# Altium schematic sheet BMS.SchDoc
size A
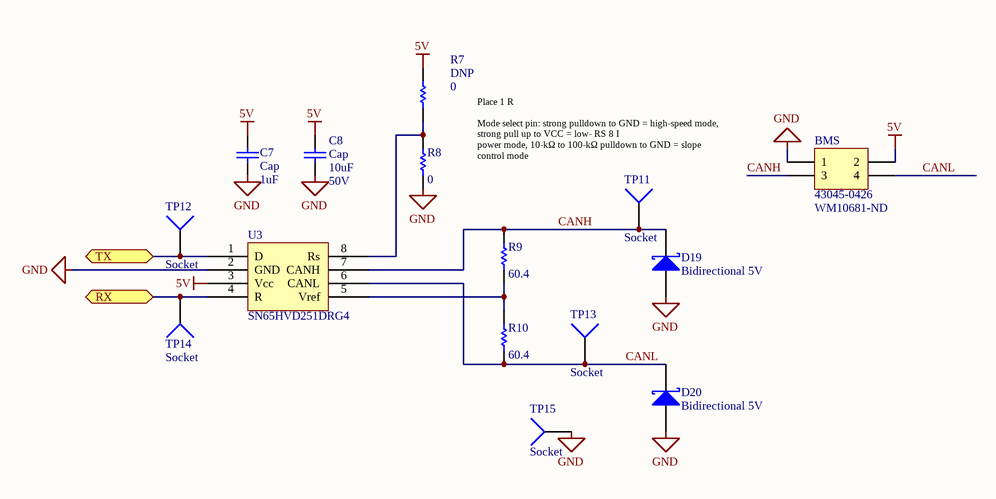
[diagram p0: BMS.SchDoc]

## Parts
BMS  43045-0426  Vendor Part Number: WM10681-ND  [43045-0426]
C7  Cap  value 1uF  [RESC3116X65N]
C8  Cap  value 10uF  Voltage Rating: 50V  [CAPC3216X180N]
D19  Bidirectional 5V  [THRMC0603X33N]
D20  Bidirectional 5V  [THRMC0603X33N]
R7  value 0  [0402]  (hidden comment: Res1)
R8  value 0  [0402]  (hidden comment: Res1)
R9  value 60.4  [0402]  (hidden comment: Res1)
R10  value 60.4  [0402]  (hidden comment: Res1)
TP11  Socket  [5006]
TP12  Socket  [5006]
TP13  Socket  [5006]
TP14  Socket  [5006]
TP15  Socket  [5006]
U3  SN65HVD251DRG4  [SOIC127P599X175-8N]

## Ports
RX, TX

## Nets
5V: BMS.2 C7.2 C8.2 R7.1 U3.3(Vcc)
GND: BMS.1 C7.1 C8.1 D19.3(A) D20.3(A) R8.2 TP15.1 U3.2(GND)
CANH: BMS.3 D19.1(K) R9.1 TP11.1 U3.7(CANH)
CANL: BMS.4 D20.1(K) R10.2 TP13.1 U3.6(CANL)
RX: TP14.1 U3.4(R) ; port RX
TX: TP12.1 U3.1(D) ; port TX
NetR7_2: R7.2 R8.1 U3.8(Rs)
NetR9_2: R9.2 R10.1 U3.5(Vref)

## Notes on the sheet
- Place 1 R
  Mode select pin: strong pulldown to GND = high-speed mode, strong pull up to VCC = low- RS 8 I
  power mode, 10-kΩ to 100-kΩ pulldown to GND = slope control mode

## Library data of the parts
BMS = Header 2X2: Header, 2-Pin, Dual row; LatestRevisionDate: 17-Jul-2002; LatestRevisionNote: Re-released for DXP Platform.; Publisher: Altium Limited
C7 = Cap: Capacitor; Manufacturer Part Number: CL31B105KCHNNNE; Vendor Part Number: 1276-1838-1-ND
C8 = Cap: Capacitor; Manufacturer Part Number: CL31A106MBHNNNE; Vendor Part Number: 1276-6736-1-ND
D19 D20 = Diode 10TQ040: TVS; Manufacturer Part Number: CPDUC5V0R-HF; Vendor Part Number: 641-1764-1-ND
R7 R8 = Res1: Resistor; Manufacturer Part Number: RC0402FR-070RL; Vendor Part Number: 311-0.0LRCT-ND; Tolerance: 1%
  R7: DNP: DNP
R9 R10 = Res1: Resistor; Manufacturer Part Number: RC0402FR-0760R4L; Vendor Part Number: 311-60.4LRCT-ND; Tolerance: 1%
TP11-TP15 = Socket: Vendor Part Number: 36-5006-ND; LatestRevisionDate: 17-Jul-2002; LatestRevisionNote: Re-released for DXP Platform.; Publisher: Altium Limited; Manufacturer Part Number: 5006
U3 = SN65HVD251DRG4: Vendor Part Number: 296-21805-1-ND; Manufacturer Part Number: SN65HVD251DRG4